# Altium project GNSS_FE.PrjPcb
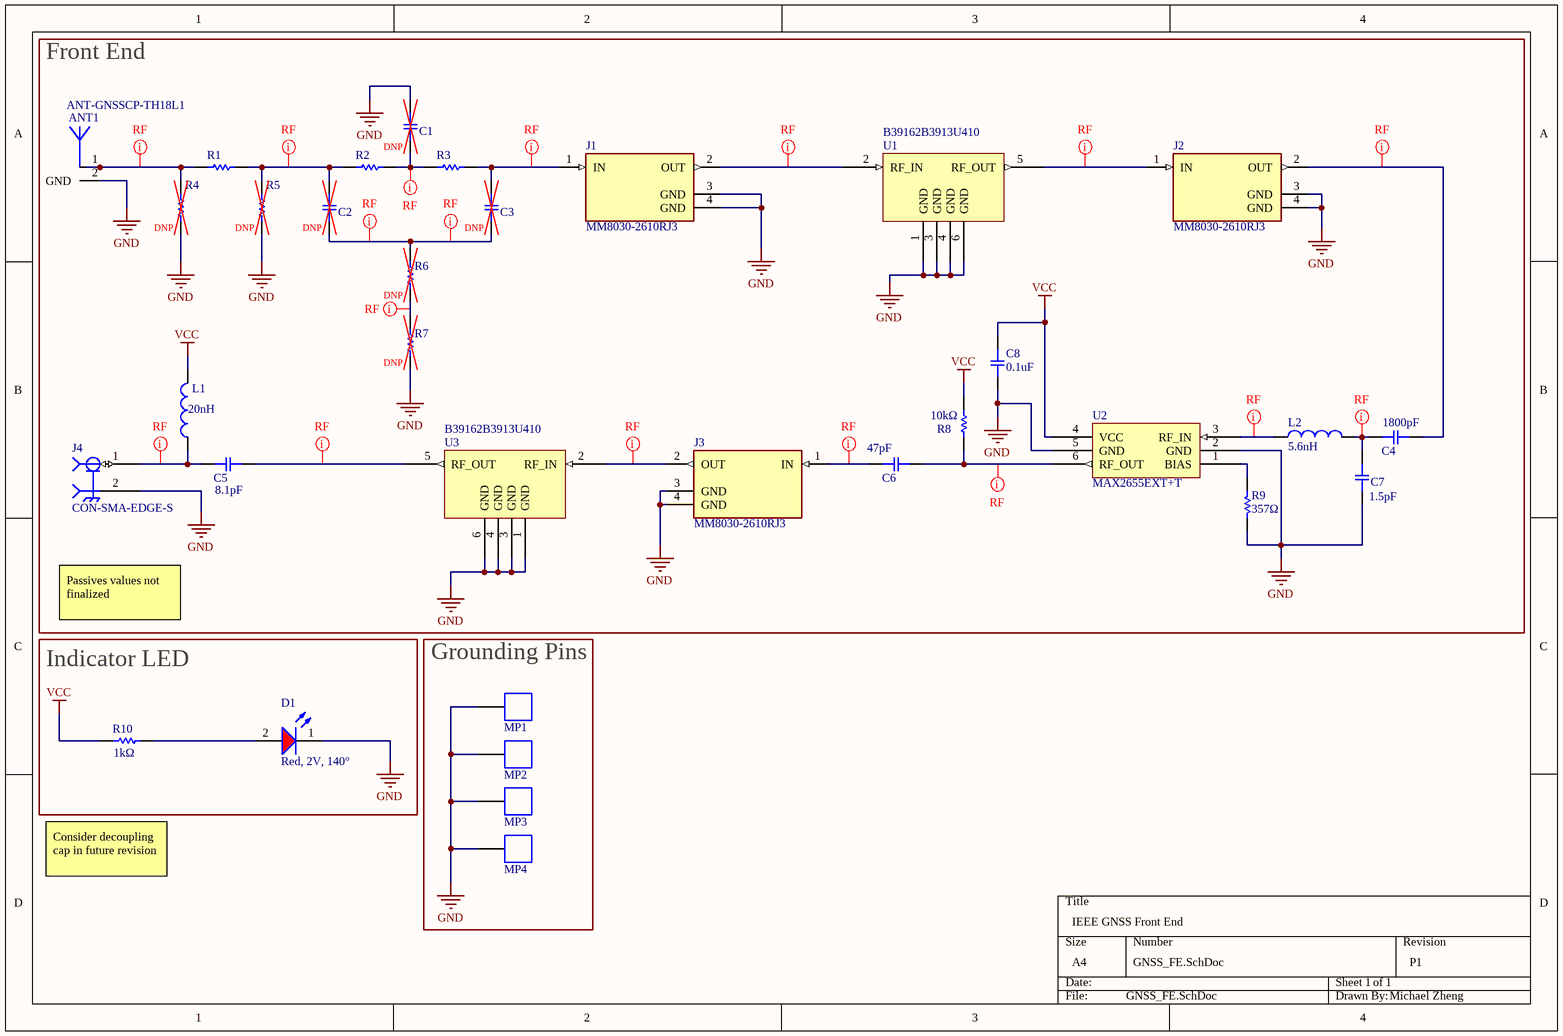
[diagram p0: GNSS_FE.SchDoc]
Author: Michael Zheng; Revision: P1; Title: IEEE GNSS Front End
1 sheet, 33 parts. Net scope: global (net labels, ports and power ports of the same name join across sheets).
Board file: GNSS_FE.PcbDoc

## Sheet GNSS_FE.SchDoc: IEEE GNSS Front End
size A4; SheetNumber: 1; SheetTotal: 1

### Parts
ANT1  ANT-GNSSCP-TH18L1  [ANT-GNSSCP-TH18L1]
C1  GRM1555C1H102JA01D  [0402_CAP]  (value not drawn)
C2  GRM1555C1H102JA01D  [0402_CAP]  (value not drawn)
C3  GRM1555C1H102JA01D  [0402_CAP]  (value not drawn)
C4  Capacitance: 1800pF  [0402_CAP]  (hidden comment: GRM1555C1H182JA01D)
C5  Capacitance: 8.1pF  [0402_CAP]  (hidden comment: GJM1555C1H8R1BB01D)
C6  Capacitance: 47pF  [0402_CAP]  (hidden comment: GJM1555C1H470FB01D)
C7  Capacitance: 1.5pF  [0402_CAP]  (hidden comment: GJM1555C1H1R5WB01D)
C8  Capacitance: 0.1uF  [CAP_MURATA_0603]  (hidden comment: GCM188L81H104KA57D)
D1  Red, 2V, 140°  [WL-SMCW]
J1  MM8030-2610RJ3  [MURATA_MM8030-2610RJ3]
J2  MM8030-2610RJ3  [MURATA_MM8030-2610RJ3]
J3  MM8030-2610RJ3  [MURATA_MM8030-2610RJ3]
J4  CON-SMA-EDGE-S  [RFSOLUTIONS_CON-SMA-EDGE-S]
L1  value 20nH  [INDC1006X60N]  (hidden comment: LQW15AN20NG8ZD)
L2  value 5.6nH  [INDC1006X60N]  (hidden comment: LQG15HN5N6C02D)
MP1  36900000  [36900000]  (value not drawn)
MP2  36900000  [36900000]  (value not drawn)
MP3  36900000  [36900000]  (value not drawn)
MP4  36900000  [36900000]  (value not drawn)
R1  RC0402JR-070RL  [0402_CAP]  (value not drawn)
R2  RC0402JR-070RL  [0402_CAP]  (value not drawn)
R3  RC0402JR-070RL  [0402_CAP]  (value not drawn)
R4  RC0402JR-070RL  [0402_CAP]  (value not drawn)
R5  RC0402JR-070RL  [0402_CAP]  (value not drawn)
R6  RC0402JR-070RL  [0402_CAP]  (value not drawn)
R7  RC0402JR-070RL  [0402_CAP]  (value not drawn)
R8  Resistance: 10kΩ  [0402_CAP]  (hidden comment: RC0402FR-0710KL)
R9  Resistance: 357Ω  [RC0603JR-070RL]  (hidden comment: RC0402FR-07357RL)
R10  Resistance: 1kΩ  [RC0603JR-070RL]  (hidden comment: RC0603FR-071KL)
U1  B39162B3913U410  [B39162B3913U410]
U2  MAX2655EXT+T  [MAX2655EXT+T]
U3  B39162B3913U410  [B39162B3913U410]

### Blocks framed on the sheet
Front End: ANT1 C1-C8 J1-J4 L1 L2 R1-R9 U1-U3
Indicator LED: D1 R10
Grounding Pins: MP1-MP4

### Nets
GND: ANT1.2(GND) C1.2 C7.1 C8.1 D1.1(K) J1.3(GND) J1.4(GND) J2.3(GND) J2.4(GND) J3.3(GND) J3.4(GND) J4.2(GND) MP1.1 MP2.1 MP3.1 MP4.1 R4.1 R5.1 R7.2 R9.2 U1.1(GND) U1.3(GND) U1.4(GND) U1.6(GND) U2.2(GND) U2.5(GND) U3.1(GND) U3.3(GND) U3.4(GND) U3.6(GND)
VCC: C8.2 L1.2 R8.1 R10.1 U2.4(VCC)
NetANT1_1: ANT1.1(RF_IN) R1.2 R4.2
NetC1_1: C1.1 R2.1 R3.2
NetC2_1: C2.1 C3.1 R6.1
NetC2_2: C2.2 R1.1 R2.2 R5.2
NetC3_2: C3.2 J1.1(IN) R3.1
NetC4_1: C4.1 J2.2(OUT)
NetC4_2: C4.2 C7.2 L2.2
NetC5_1: C5.1 U3.5(RF_OUT)
NetC5_2: C5.2 J4.1(RF) L1.1
NetC6_1: C6.1 R8.2 U2.6(RF_OUT)
NetC6_2: C6.2 J3.1(IN)
NetD1_2: D1.2(A) R10.2
NetJ1_2: J1.2(OUT) U1.2(RF_IN)
NetJ2_1: J2.1(IN) U1.5(RF_OUT)
NetJ3_2: J3.2(OUT) U3.2(RF_IN)
NetL2_1: L2.1 U2.3(RF_IN)
NetR6_2: R6.2 R7.1
NetR9_1: R9.1 U2.1(BIAS)

### Layout directives
net class RF: NetANT1_1, NetC1_1, NetC2_1, NetC2_2, NetC3_2, NetC4_1, NetC4_2, NetC5_1, NetC5_2, NetC6_1, NetC6_2, NetJ1_2, NetJ2_1, NetJ3_2, NetL2_1, NetR6_2

### Notes on the sheet
- DNP
- (near R4) DNP
- (near R5) DNP
- (near C2) DNP
- (near C3) DNP
- (near R6) DNP
- (near R7) DNP
- Passives values not finalized
- Consider decoupling cap in future revision

### Library data of the parts
ANT1 = ANT-GNSSCP-TH18L1: CERAMIC PATCH GNSS ANTENNA
C1-C3 = GRM1555C1H102JA01D: CAP CER 1000PF 50V C0G/NP0 0402; Capacitance: 1uF
C4 = GRM1555C1H102JA01D: CAP CER 1800PF 50V C0G/NP0 0402
C5 = GRM1555C1H102JA01D: CAP CER 8.1PF 50V C0G/NP0 0402
C6 = GRM1555C1H102JA01D: CAP CER 47PF 50V C0G/NP0 0402
C7 = GRM1555C1H102JA01D: CAP CER 1.5PF 50V C0G/NP0 0402
C8 = GCM188L81H104KA57D: CAP CER 0.1UF 50V X8L 0603
D1 = 150060RS75000: WL-SMCW Mono-color Chip LED Waterclear, SMT, size 0603, Red, 2V, 140°; Manufacturer: Wurth Elektronik; Case/Size Code: 0603; Chip Technology: AlInGaP; Dominant Wavelength: 625nm; Luminous Intensity: 250mcd; Peak Wavelength: 630nm; Manufacturer Part Number: 150060RS75000; Category: Signal LEDs; Match Code: WL-SMCW; ComponentLink1Description: Website Link; ComponentLink1URL: https://www.we-online.com/redexpert/article/150060RS75000?ad; ComponentLink2Description: Datasheet Link; ComponentLink2URL: https://www.we-online.com/redexpert/spec/150060RS75000?ad; Mount: Surface Mount; Operating Temperature Max: 85°C; Operating Temperature Min: -40°C; Packaging: Tape and Reel; Length: 1.6mm; Width: 0.8mm; Height: 0.7mm; Emitting Color: Red; Forward Voltage: 2V; Viewing Angle: 140°
J1-J3 = MM8030-2610RJ3: SWG Connector Receptacle, Female Socket 50Ohm Surface Mount Solder; MF: Murata; MP: MM8030-2610RJ3; Package: None; SnapEDA_Link: https://www.snapeda.com/parts/MM8030-2610RJ3/Murata%20Electronics%20North%20America/view-part/271470/?ref=snap; Digi-Key_Purchase_URL: https://www.digikey.com/product-detail/en/murata-electronics/MM8030-2610RJ3/490-5907-1-ND/3635133?utm_source=snapeda&utm_medium=aggregator&utm_campaign=symbol; Value: *; Digi-Key_Part_Number: 490-5907-1-ND
J4 = CON-SMA-EDGE-S: CONN SMA JACK STR EDGE MNT
L1 = LQW15AN3N6C10D: FIXED IND 20NH 800MA 0.186OHM SM; Package: None; Price: None; MP: LQW15AN3N6C10D; Availability: Unavailable
L2 = LQW15AN3N6C10D: FIXED IND 5.6NH 600MA 0.18OHM SM; Package: None; Price: None; MP: LQW15AN3N6C10D; Availability: Unavailable
MP1-MP4 = 36900000: WE-SHC Shielding Cabinet, Clip, Tin Plated, Tape and Reel, 6.5x0.8x1.27mm; Manufacturer: Wurth Elektronik; Base Material: Steel; ComponentLink1Description: Website Link; ComponentLink1URL: https://www.we-online.com/redexpert/article/36900000?ad; ComponentLink2Description: Datasheet Link; ComponentLink2URL: https://www.we-online.com/redexpert/spec/36900000?ad; Manufacturer Part Number: 36900000; Category: EMC Shielding; Match Code: WE-SHC; Mount: Surface Mount; Operating Temperature Max: 125°C; Operating Temperature Min: -40°C; Packaging: Tape and Reel; Length: 6.5mm; Width: 0.8mm; Height: 1.27mm; Plating: Tin Plated; Type: Clip
R1-R7 = RC0402JR-070RL: RES 0 OHM JUMPER 1/16W 0402; Manufacturer: Yageo; Temperature Coefficient: 200ppm/degreesC; Tolerance: 5%; Voltage Rating: 50V; Power Rating: 100mW; Resistance: 0mOhm; Width: 0.8mm; Max Operating Temperature: 155degC; Package Reference: 0603; Height: 0.45mm; Depth: 0.8mm; Package Description: 2-Pin Surface Mount Device, Body 1.6 x 0.8 mm; Termination: SMD/SMT; Package Quantity: 5000; Case/Package: 0603; Case Code (Imperial): 0603; Radiation Hardening: No; Number of Pins: 2; Length: 1.6mm; Lead Free: LeadFree; Voltage Rating (DC): 50V; Military Standard: Not; Datasheet URL: http://www.yageo.com/NewPortal/yageodocoutput?fileName=/pdf/R-Chip/PYu-RC_Group_51_RoHS_L_5.pdf; Manufacturer URL: http://www.yageo.com/; Packaging: TapeandReel; Case Code (Metric): 1608; Min Operating Temperature: -55degC; Composition: ThickFilm; RoHSCompliant: true; Contact Plating: Tin; Datasheet Version: Rev. 5, 10/2016; REACH SVHC: NoSVHC
R8 = RC0402JR-070RL: RES 10K OHM 1% 1/16W 0402; Manufacturer: Yageo; Temperature Coefficient: 200ppm/degreesC; Tolerance: 5%; Voltage Rating: 50V; Power Rating: 100mW; Width: 0.8mm; Max Operating Temperature: 155degC; Package Reference: 0603; Height: 0.45mm; Depth: 0.8mm; Package Description: 2-Pin Surface Mount Device, Body 1.6 x 0.8 mm; Termination: SMD/SMT; Package Quantity: 5000; Case/Package: 0603; Case Code (Imperial): 0603; Radiation Hardening: No; Number of Pins: 2; Length: 1.6mm; Lead Free: LeadFree; Voltage Rating (DC): 50V; Military Standard: Not; Datasheet URL: http://www.yageo.com/NewPortal/yageodocoutput?fileName=/pdf/R-Chip/PYu-RC_Group_51_RoHS_L_5.pdf; Manufacturer URL: http://www.yageo.com/; Packaging: TapeandReel; Case Code (Metric): 1608; Min Operating Temperature: -55degC; Composition: ThickFilm; RoHSCompliant: true; Contact Plating: Tin; Datasheet Version: Rev. 5, 10/2016; REACH SVHC: NoSVHC
R9 = RC0603JR-070RL: RES 357 OHM 1% 1/16W 0402; Manufacturer: Yageo; Temperature Coefficient: 200ppm/degreesC; Tolerance: 5%; Voltage Rating: 50V; Power Rating: 100mW; Width: 0.8mm; Max Operating Temperature: 155degC; Package Reference: 0603; Height: 0.45mm; Depth: 0.8mm; Package Description: 2-Pin Surface Mount Device, Body 1.6 x 0.8 mm; Termination: SMD/SMT; Package Quantity: 5000; Case/Package: 0603; Case Code (Imperial): 0603; Radiation Hardening: No; Number of Pins: 2; Length: 1.6mm; Lead Free: LeadFree; Voltage Rating (DC): 50V; Military Standard: Not; Datasheet URL: http://www.yageo.com/NewPortal/yageodocoutput?fileName=/pdf/R-Chip/PYu-RC_Group_51_RoHS_L_5.pdf; Manufacturer URL: http://www.yageo.com/; Packaging: TapeandReel; Case Code (Metric): 1608; Min Operating Temperature: -55degC; Composition: ThickFilm; RoHSCompliant: true; Contact Plating: Tin; Datasheet Version: Rev. 5, 10/2016; REACH SVHC: NoSVHC
R10 = RC0603JR-070RL: 1 kOhms ±1% 0.1W, 1/10W Chip Resistor 0603 (1608 Metric) Moisture Resistant Thick Film; Manufacturer: Yageo; Temperature Coefficient: 200ppm/degreesC; Tolerance: 5%; Voltage Rating: 50V; Power Rating: 100mW; Width: 0.8mm; Max Operating Temperature: 155degC; Package Reference: 0603; Height: 0.45mm; Depth: 0.8mm; Package Description: 2-Pin Surface Mount Device, Body 1.6 x 0.8 mm; Termination: SMD/SMT; Package Quantity: 5000; Case/Package: 0603; Case Code (Imperial): 0603; Radiation Hardening: No; Number of Pins: 2; Length: 1.6mm; Lead Free: LeadFree; Voltage Rating (DC): 50V; Military Standard: Not; Datasheet URL: http://www.yageo.com/NewPortal/yageodocoutput?fileName=/pdf/R-Chip/PYu-RC_Group_51_RoHS_L_5.pdf; Manufacturer URL: http://www.yageo.com/; Packaging: TapeandReel; Case Code (Metric): 1608; Min Operating Temperature: -55degC; Composition: ThickFilm; RoHSCompliant: true; Contact Plating: Tin; Datasheet Version: Rev. 5, 10/2016; REACH SVHC: NoSVHC
U1 U3 = B39162B3913U410: FILTER SAW 1.588GHZ 6SMD
U2 = MAX2655EXT+T: IC AMP GPS 1.4GHZ-1.7GHZ SC70-6

## Assembly variants
Variant of GNSS_FE: not fitted C1 C2 C3 R4 R5 R6 R7